# Altium project PCB_Project1.PrjPCB
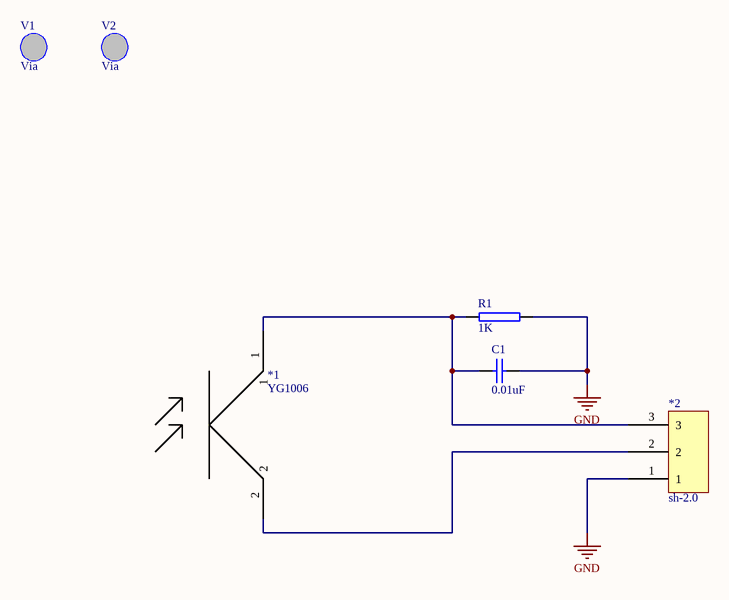
[diagram p0: Sheet1.SchDoc]
1 sheet, 6 parts. Net scope: global (net labels, ports and power ports of the same name join across sheets).
Board file: PCB1.PcbDoc

## Sheet Sheet1.SchDoc
size A4

### Parts
*1  YG1006  [Q]
*2  sh-2.0  [sh-2.0]
C1  0.01uF  [1608[0603]]
R1  1K  [1608[0603]]
V1  Via  [Via]
V2  Via  [Via]

### Nets
GND: *2.1 C1.2 R1.2
Net*1_1: *1.1 *2.3 C1.1 R1.1
Net*1_2: *1.2 *2.2

### Library data of the parts
*2 = sh-2.0: pin to pad: 1>3 3>1
C1 = CAP
R1 = RES